# Altium project ControlSwitchPCB.PrjPcb
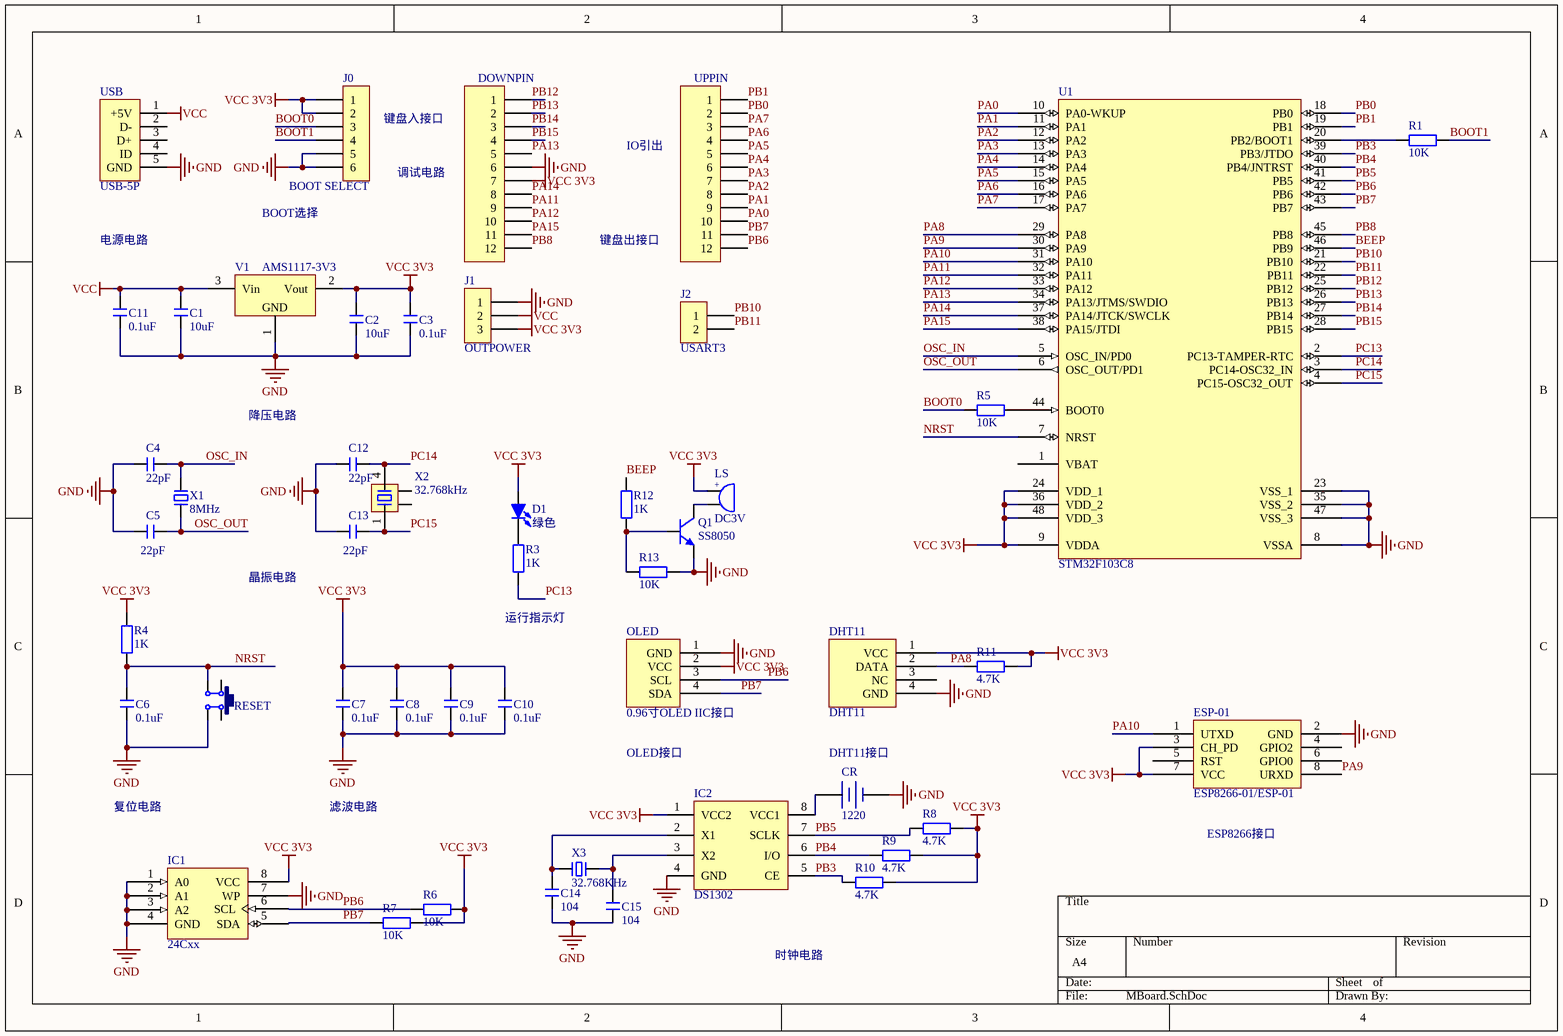
[diagram p0: MBoard.SchDoc]
3 sheets, 128 parts. Net scope: global (net labels, ports and power ports of the same name join across sheets).
Board files: MBoard.PcbDoc, SwitcherBoard.PcbDoc, MBoardBase.PcbDoc
Sheets:
  MBoard.SchDoc
  SwitcherBoard.SchDoc
  MBoardBase.SchDoc

## Sheet MBoard.SchDoc
size A4

### Parts
(Parts that share a designator on the sheet are numbered #1, #2 ... from top to bottom, then left to right.)
C1  10uF  [C 0805_L]
C2  10uF  [C 0805_L]
C3  0.1uF  [C 0805_L]
C4  22pF  [C 0805_L]
C5  22pF  [C 0805_L]
C6  0.1uF  [C 0805_L]
C7  0.1uF  [C 0805_L]
C8  0.1uF  [C 0805_L]
C9  0.1uF  [C 0805_L]
C10  0.1uF  [C 0805_L]
C11  0.1uF  [C 0805_L]
C12  22pF  [C 0805_L]
C13  22pF  [C 0805_L]
C14  104  [C 0805_L]
C15  104  [C 0805_L]
CR  1220  [CR1220_A]
D1  绿色  [LED 0805R]
DHT11  DHT11  [HDR2.54-LI-4P]
DOWNPIN  CON12  [HDR2.54-LI-12P]  (value not drawn)
ESP-01  ESP8266-01/ESP-01  [ESP-01S NOBRODER]
IC1  24Cxx  [SOP8_M]
IC2  DS1302  [SOP8_M]
J0  BOOT SELECT  [HDR2.54-LI-2x3P]
J1  OUTPOWER  [HDR2.54-LI-3P]
J2  USART3  [HDR2.54-WI-2P]
LS  DC3V  [BEEP 6.5x12x6]
OLED  0.96寸OLED IIC接口  [HDR2.54-M-LI-4P]
Q1  SS8050  [SOT23-3N]
R1  10K  [R 0805_L]
R3  1K  [R 0805_L]
R4  1K  [R 0805_L]
R5  10K  [R 0805_L]
R6  10K  [R 0805_L]
R7  10K  [R 0805_L]
R8  4.7K  [R 0805_L]
R9  4.7K  [R 0805_L]
R10  4.7K  [R 0805_L]
R11  4.7K  [R 0805_L]
R12  1K  [R 0805_L]
R13  10K  [R 0805_L]
RESET  6x6x5  [TSW SMD-6*6*4.3]  (value not drawn)
U1  STM32F103C8  [LQFP48 7X7_M]
UPPIN#1  CON12  [HDR2.54-LI-12P]  (value not drawn)
USB  USB-5P  [USB-MICRO_A]
V1  AMS1117-3V3  [SOT223_L]
X1  8MHz  [OSC HC-49S]
X2  32.768kHz  [OSC MC-306]
X3  32.768KHz  [OSC-2x6-WI-A]

### Nets
GND: C1.1 C2.1 C3.1 C4.1 C5.1 C6.1 C7.1 C8.1 C9.1 C10.1 C11.1 C12.1 C13.1 C14.1 C15.1 CR.2(DC-) DHT11.4(GND) DOWNPIN.6 ESP-01.2(GND) IC1.1(A0) IC1.2(A1) IC1.3(A2) IC1.4(GND) IC1.7(WP) IC2.4(GND) J0.5 J0.6 J1.1 OLED.1(GND) Q1.2(E) R13.2 RESET.3 U1.8(VSSA) U1.23(VSS_1) U1.35(VSS_2) U1.47(VSS_3) USB.5(GND) V1.1(GND)
VCC: C1.2 C11.2 J1.2 USB.1(+5V) V1.3(Vin)
VCC 3V3: C2.2 C3.2 C7.2 C8.2 C9.2 C10.2 D1.1(A) DHT11.1(VCC) DOWNPIN.7 ESP-01.3(CH_PD) ESP-01.7(VCC) IC1.8(VCC) IC2.1(VCC2) J0.1 J0.2 J1.3 LS.1 OLED.2(VCC) R4.2 R6.2 R7.2 R8.2 R9.2 R10.2 R11.2 U1.9(VDDA) U1.24(VDD_1) U1.36(VDD_2) U1.48(VDD_3) V1.2(Vout)
BEEP: R12.2 U1.46(PB9)
BOOT0: J0.3 R5.1
BOOT1: J0.4 R1.2
NRST: C6.2 R4.1 RESET.4 U1.7(NRST)
OSC_IN: C4.2 U1.5(OSC_IN/PD0) X1.2
OSC_OUT: C5.2 U1.6(OSC_OUT/PD1) X1.1
PA0: U1.10(PA0-WKUP) UPPIN#1.10
PA1: U1.11(PA1) UPPIN#1.9
PA2: U1.12(PA2) UPPIN#1.8
PA3: U1.13(PA3) UPPIN#1.7
PA4: U1.14(PA4) UPPIN#1.6
PA5: U1.15(PA5) UPPIN#1.5
PA6: U1.16(PA6) UPPIN#1.4
PA7: U1.17(PA7) UPPIN#1.3
PA8: DHT11.2(DATA) R11.1 U1.29(PA8)
PA9: ESP-01.8(URXD) U1.30(PA9)
PA10: ESP-01.1(UTXD) U1.31(PA10)
PA11: DOWNPIN.9 U1.32(PA11)
PA12: DOWNPIN.10 U1.33(PA12)
PA13: DOWNPIN.5 U1.34(PA13/JTMS/SWDIO)
PA14: DOWNPIN.8 U1.37(PA14/JTCK/SWCLK)
PA15: DOWNPIN.11 U1.38(PA15/JTDI)
PB0: U1.18(PB0) UPPIN#1.2
PB1: U1.19(PB1) UPPIN#1.1
PB3: IC2.5(CE) R10.1 U1.39(PB3/JTDO)
PB4: IC2.6(I/O) R9.1 U1.40(PB4/JNTRST)
PB5: IC2.7(SCLK) R8.1 U1.41(PB5)
PB6: IC1.6(SCL) OLED.3(SCL) R6.1 U1.42(PB6) UPPIN#1.12
PB7: IC1.5(SDA) OLED.4(SDA) R7.1 U1.43(PB7) UPPIN#1.11
PB8: DOWNPIN.12 U1.45(PB8)
PB10: J2.1 U1.21(PB10)
PB11: J2.2 U1.22(PB11)
PB12: DOWNPIN.1 U1.25(PB12)
PB13: DOWNPIN.2 U1.26(PB13)
PB14: DOWNPIN.3 U1.27(PB14)
PB15: DOWNPIN.4 U1.28(PB15)
PC13: R3.1 U1.2(PC13-TAMPER-RTC)
PC14: C12.2 U1.3(PC14-OSC32_IN) X2.4
PC15: C13.2 U1.4(PC15-OSC32_OUT) X2.1
NetC14_2: C14.2 IC2.2(X1) X3.1
NetC15_2: C15.2 IC2.3(X2) X3.2
NetCR_1: CR.1(DC+) IC2.8(VCC1)
NetD1_2: D1.2(K) R3.2
NetLS_2: LS.2 Q1.3(C)
NetQ1_1: Q1.1(B) R12.1 R13.1
NetR1_1: R1.1 U1.20(PB2/BOOT1)
NetR5_2: R5.2 U1.44(BOOT0)

Not connected (* = marked no-connect by the designer): DHT11 3(NC); ESP-01 4(GPIO2) 5(RST) 6(GPIO0); RESET 1 2; U1 1(VBAT); USB 2(D-) 3(D+) 4(ID); X2 2 3

### Notes on the sheet
- (near J0) 键盘入接口
- 调试电路
- IO引出
- 电源电路
- BOOT选择
- 键盘出接口
- 降压电路
- 晶振电路
- (near R3) 运行指示灯
- OLED接口
- (near CR) DHT11接口
- 复位电路
- 滤波电路
- ESP8266接口
- 时钟电路
- (in symbol BEEP) +

### Library data of the parts
C1-C15 = C: 无极性贴片电容; 版权归属: 源创客; BOM名称: 无极性贴片电容; 学习资源: www.ooocke.com
CR = CR-3V: 微型电池; 版权归属: 源创客; BOM名称: 微型电池; 学习资源: www.ooocke.com
D1 = LED-SMD: 贴片LED; 版权归属: 源创客; BOM名称: 贴片LED; 学习资源: www.ooocke.com
DOWNPIN UPPIN#1 = CON12: Connector
ESP-01 = ESP8266-01: ESP8266-01 接口
IC1 = 24Cxx: 外置EEPROM; 版权归属: 源创客; BOM名称: 外置EEPROM; 学习资源: www.ooocke.com
IC2 = DS1302: 实时时钟芯片; 版权归属: 源创客; BOM名称: 实时时钟芯片; 学习资源: www.ooocke.com
J0 = CON6: Connector
J1 = CON3: Connector
J2 = CON2: Connector
LS = BEEP: 蜂鸣器; 版权归属: 源创客; BOM名称: 蜂鸣器; 学习资源: www.ooocke.com
OLED = OLED0.96_IIC: 0.96寸OLED  IIC接口
Q1 = 8050-SMD: 高频放大-NPN型; 版权归属: 源创客; 属性: 40V 1.5A 1W 100MHZ; BOM名称: 高频放大-NPN型; 学习资源: www.ooocke.com
R1 R3-R13 = R: 贴片电阻; 版权归属: 源创客; BOM名称: 贴片电阻; 学习资源: www.ooocke.com
RESET = TSW SMD-6x6: 贴片6x6轻触开关; 版权归属: 源创客; BOM名称: 贴片6x6轻触开关; 学习资源: www.ooocke.com
U1 = STM32F103C8: Flaah:64/RAM:20/IO:36; BOM名称: 32位STM单片机; 版权归属: 源创客; 学习资源: www.ooocke.com
USB = USB-5P: 微型USB母座; 版权归属: 源创客; BOM名称: 微型USB母座; 学习资源: www.ooocke.com
V1 = AMS1117: 三端稳压芯片; BOM名称: 稳压芯片; 版权归属: 源创客; 学习资源: www.ooocke.com
X1 X3 = XTAL-2P: 2脚无源脚晶振; 版权归属: 源创客; BOM名称: 2脚无源脚晶振; 学习资源: www.ooocke.com
X2 = XTAL-MC-4P: MC系列4脚晶振; BOM名称: 2脚无源脚晶振; 版权归属: 源创客; 学习资源: www.ooocke.com

## Sheet SwitcherBoard.SchDoc
size A4
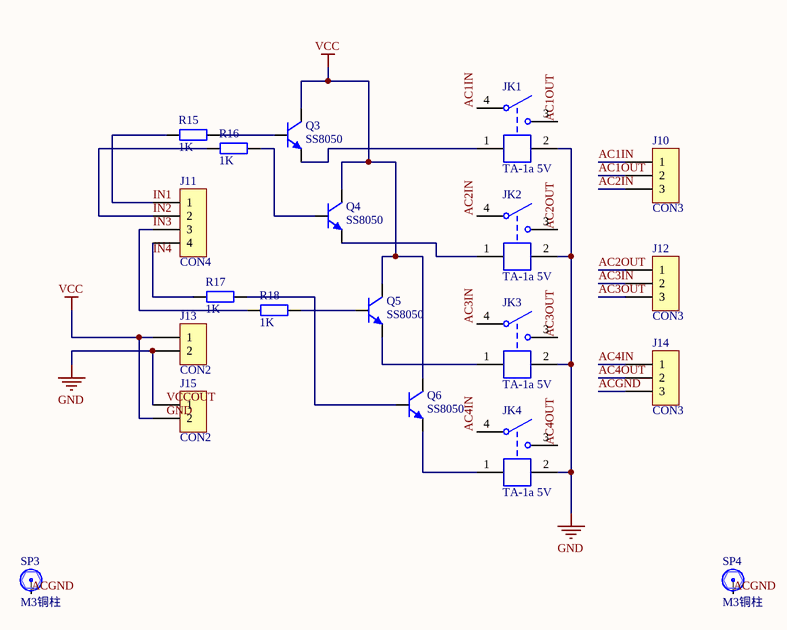
[diagram p1: SwitcherBoard.SchDoc]

### Parts
(Parts that share a designator on the sheet are numbered #1, #2 ... from top to bottom, then left to right.)
J10#1  CON3  [KF128-5.08-3P]
J11  CON4  [HDR2.54-WI-4P]
J12  CON3  [KF128-5.08-3P]
J13  CON2  [HDR2.54-WI-2P]
J14  CON3  [KF128-5.08-3P]
J15  CON2  [HDR2.54-WI-2P]
JK1  TA-1a 5V  [TA-1a]
JK2  TA-1a 5V  [TA-1a]
JK3  TA-1a 5V  [TA-1a]
JK4  TA-1a 5V  [TA-1a]
Q3  SS8050  [TO92A]
Q4  SS8050  [TO92A]
Q5  SS8050  [TO92A]
Q6  SS8050  [TO92A]
R15  1K  [RS 1/4W]
R16  1K  [RS 1/4W]
R17  1K  [RS 1/4W]
R18  1K  [RS 1/4W]
SP3  M3铜柱  [M3x4_L]
SP4  M3铜柱  [M3x4_L]

### Nets
GND: J13.2 J15.1 JK1.2 JK2.2 JK3.2 JK4.2
VCC: J13.1 J15.2 Q3.3(C) Q4.3(C) Q5.3(C) Q6.3(C)
AC1IN: J10#1.1 JK1.4
AC1OUT: J10#1.2 JK1.3
AC2IN: J10#1.3 JK2.4
AC2OUT: J12.1 JK2.3
AC3IN: J12.2 JK3.4
AC3OUT: J12.3 JK3.3
AC4IN: J14.1 JK4.4
AC4OUT: J14.2 JK4.3
ACGND: J14.3 SP3.1 SP4.1
IN1: J11.1 R15.1
IN2: J11.2 R16.1
IN3: J11.3 R18.1
IN4: J11.4 R17.1
NetJK1_1: JK1.1 Q3.1(E)
NetJK2_1: JK2.1 Q4.1(E)
NetJK3_1: JK3.1 Q5.1(E)
NetJK4_1: JK4.1 Q6.1(E)
NetQ3_2: Q3.2(B) R15.2
NetQ4_2: Q4.2(B) R16.2
NetQ5_2: Q5.2(B) R18.2
NetQ6_2: Q6.2(B) R17.2

### Notes on the sheet
- Labels drawn without touching a wire or pin: GND, VCCOUT

### Library data of the parts
J10#1 J12 J14 = CON3: Connector
J11 = CON4: Connector
J13 J15 = CON2: Connector
JK1-JK4 = TA-1a: 一组常开; BOM名称: 一组常开继电器; 版权归属: 源创客; 学习资源: www.ooocke.com
Q3-Q6 = 8050-DIP: 高频放大-NPN型; 版权归属: 源创客; 属性: 40V 1.5A 1W 100MHZ; BOM名称: 高频放大-NPN型; 学习资源: www.ooocke.com
R15-R18 = R-CRR: 直插色环电阻; BOM名称: 色环电阻; 版权归属: 源创客; 学习资源: www.ooocke.com
SP3 SP4 = 铜柱小焊盘: 铜柱; 版权归属: 源创客; BOM名称: 铜柱; 学习资源: www.ooocke.com

## Sheet MBoardBase.SchDoc
size 312 x 241 mm
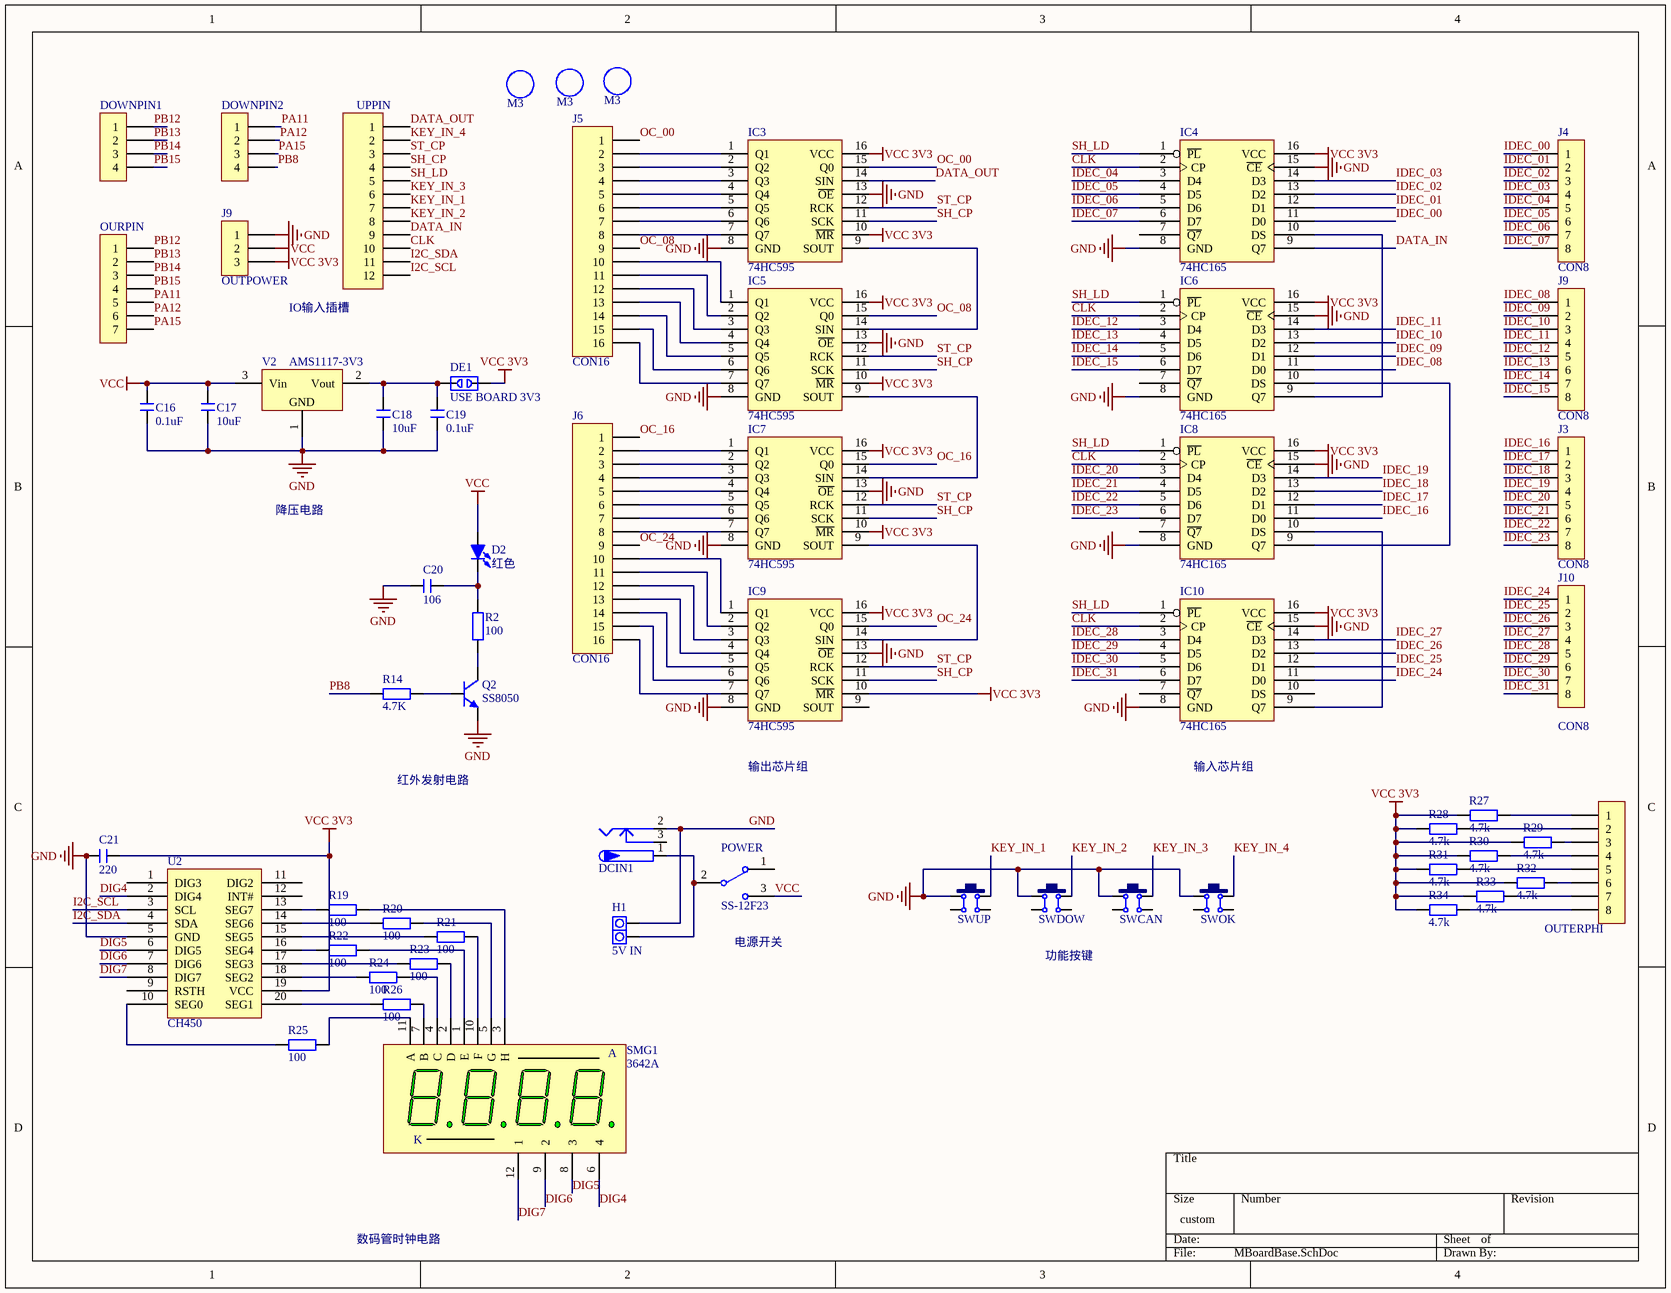
[diagram p2: MBoardBase.SchDoc]

### Parts
(Parts that share a designator on the sheet are numbered #1, #2 ... from top to bottom, then left to right.)
*#1  M3  [M3 125X200]
*#2  M3  [M3 125X200]
*#3  M3  [M3 125X200]
C16  0.1uF  [C 0805_L]
C17  10uF  [C 0805_L]
C18  10uF  [C 0805_L]
C19  0.1uF  [C 0805_L]
C20  106  [C 0805_L]
C21  220  [C 0805_L]
D2  红色  [LED 3MM-B]
DCIN1  DC5V  [DC-005]  (value not drawn)
DE1  USE BOARD 3V3  [DEBUG_A]
DOWNPIN1  CON4  [HDR2.54-M-LI-4P]  (value not drawn)
DOWNPIN2  CON4  [HDR2.54-M-LI-4P]  (value not drawn)
H1  5V IN  [PAD2-5.08]
IC3  74HC595  [SOP16_M]
IC4  74HC165  [SOP16_M]
IC5  74HC595  [SOP16_M]
IC6  74HC165  [SOP16_M]
IC7  74HC595  [SOP16_M]
IC8  74HC165  [SOP16_M]
IC9  74HC595  [SOP16_M]
IC10  74HC165  [SOP16_M]
J3  CON8  [FPC1.0-2H-WS-8P]
J4  CON8  [FPC1.0-2H-WS-8P]
J5  CON16  [HDR2.54-WI-2x8P]
J6  CON16  [HDR2.54-WI-2x8P]
J9#1  OUTPOWER  [HDR2.54-M-LI-3P]
J9#2  CON8  [FPC1.0-2H-WS-8P]
J10#2  CON8  [FPC1.0-2H-WS-8P]
OURPIN  CON7  [HDR2.54-LI-7P]  (value not drawn)
OUTERPHI  CON8  [HDR2.54-WI-2x4P]  (value not drawn)
POWER  SS-12F23  [SS-12F23]
Q2  SS8050  [SOT23-3L]
R2  100  [R 0805_L]
R14  4.7K  [R 0805_L]
R19  100  [R 0805_L]
R20  100  [R 0805_L]
R21  100  [R 0805_L]
R22  100  [R 0805_L]
R23  100  [R 0805_L]
R24  100  [R 0805_L]
R25  100  [R 0805_L]
R26  100  [R 0805_L]
R27  4.7k  [R 0805_L]
R28  4.7k  [R 0805_L]
R29  4.7k  [R 0805_L]
R30  4.7k  [R 0805_L]
R31  4.7k  [R 0805_L]
R32  4.7k  [R 0805_L]
R33  4.7k  [R 0805_L]
R34  4.7k  [R 0805_L]
SMG1  3642A  [SMG 0.36-4P]
SWCAN  CANCEL  [TSW SMD-6*6*4.3]  (value not drawn)
SWDOW  DOWN  [TSW SMD-6*6*4.3]  (value not drawn)
SWOK  OK  [TSW SMD-6*6*4.3]  (value not drawn)
SWUP  UP  [TSW SMD-6*6*4.3]  (value not drawn)
U2  CH450  [sop20_m]
UPPIN#2  CON12  [HDR2.54-M-LI-12P]  (value not drawn)
V2  AMS1117-3V3  [SOT223_L]

### Nets
GND: C16.1 C17.1 C18.1 C19.1 C20.1 C21.1 DCIN1.2 H1.2 IC3.8(GND) IC3.13(~{OE}) IC4.8(GND) IC4.15(~{CE}) IC5.8(GND) IC5.13(~{OE}) IC6.8(GND) IC6.15(~{CE}) IC7.8(GND) IC7.13(~{OE}) IC8.8(GND) IC8.15(~{CE}) IC9.8(GND) IC9.13(~{OE}) IC10.8(GND) IC10.15(~{CE}) J9#1.1 Q2.1(E) SWCAN.1 SWDOW.1 SWOK.1 SWUP.1 U2.5(GND) V2.1(GND)
VCC: C16.2 C17.2 D2.1(A) J9#1.2 POWER.3 V2.3(Vin)
VCC 3V3: C21.2 DE1.2 IC3.10(~{MR}) IC3.16(VCC) IC4.16(VCC) IC5.10(~{MR}) IC5.16(VCC) IC6.16(VCC) IC7.10(~{MR}) IC7.16(VCC) IC8.16(VCC) IC9.10(~{MR}) IC9.16(VCC) IC10.16(VCC) J9#1.3 R27.1 R28.1 R29.1 R30.1 R31.1 R32.1 R33.1 R34.1 U2.19(VCC)
CLK: IC4.2(CP) IC6.2(CP) IC8.2(CP) IC10.2(CP) UPPIN#2.10
DATA_IN: IC4.9(Q7) UPPIN#2.9
DATA_OUT: IC3.14(SIN) UPPIN#2.1
DIG4: SMG1.6(4) U2.2(DIG4)
DIG5: SMG1.8(3) U2.6(DIG5)
DIG6: SMG1.9(2) U2.7(DIG6)
DIG7: SMG1.12(1) U2.8(DIG7)
I2C_SCL: U2.3(SCL) UPPIN#2.12
I2C_SDA: U2.4(SDA) UPPIN#2.11
IDEC_00: IC4.11(D0) J4.1
IDEC_01: IC4.12(D1) J4.2
IDEC_02: IC4.13(D2) J4.3
IDEC_03: IC4.14(D3) J4.4
IDEC_04: IC4.3(D4) J4.5
IDEC_05: IC4.4(D5) J4.6
IDEC_06: IC4.5(D6) J4.7
IDEC_07: IC4.6(D7) J4.8
IDEC_08: IC6.11(D0) J9#2.1
IDEC_09: IC6.12(D1) J9#2.2
IDEC_10: IC6.13(D2) J9#2.3
IDEC_11: IC6.14(D3) J9#2.4
IDEC_12: IC6.3(D4) J9#2.5
IDEC_13: IC6.4(D5) J9#2.6
IDEC_14: IC6.5(D6) J9#2.7
IDEC_15: IC6.6(D7) J9#2.8
IDEC_16: IC8.11(D0) J3.1
IDEC_17: IC8.12(D1) J3.2
IDEC_18: IC8.13(D2) J3.3
IDEC_19: IC8.14(D3) J3.4
IDEC_20: IC8.3(D4) J3.5
IDEC_21: IC8.4(D5) J3.6
IDEC_22: IC8.5(D6) J3.7
IDEC_23: IC8.6(D7) J3.8
IDEC_24: IC10.11(D0) J10#2.1
IDEC_25: IC10.12(D1) J10#2.2
IDEC_26: IC10.13(D2) J10#2.3
IDEC_27: IC10.14(D3) J10#2.4
IDEC_28: IC10.3(D4) J10#2.5
IDEC_29: IC10.4(D5) J10#2.6
IDEC_30: IC10.5(D6) J10#2.7
IDEC_31: IC10.6(D7) J10#2.8
KEY_IN_1: SWUP.2 UPPIN#2.7
KEY_IN_2: SWDOW.2 UPPIN#2.8
KEY_IN_3: SWCAN.2 UPPIN#2.6
KEY_IN_4: SWOK.2 UPPIN#2.2
OC_00: IC3.15(Q0) J5.1
OC_08: IC5.15(Q0) J5.9
OC_16: IC7.15(Q0) J6.1
OC_24: IC9.15(Q0) J6.9
PA11: DOWNPIN2.1 OURPIN.5
PA12: DOWNPIN2.2 OURPIN.6
PA15: DOWNPIN2.3 OURPIN.7
PB8: DOWNPIN2.4 R14.1
PB12: DOWNPIN1.1 OURPIN.1
PB13: DOWNPIN1.2 OURPIN.2
PB14: DOWNPIN1.3 OURPIN.3
PB15: DOWNPIN1.4 OURPIN.4
SH_CP: IC3.11(SCK) IC5.11(SCK) IC7.11(SCK) IC9.11(SCK) UPPIN#2.4
SH_LD: IC4.1(~{PL}) IC6.1(~{PL}) IC8.1(~{PL}) IC10.1(~{PL}) UPPIN#2.5
ST_CP: IC3.12(RCK) IC5.12(RCK) IC7.12(RCK) IC9.12(RCK) UPPIN#2.3
NetC18_2: C18.2 C19.2 DE1.1 V2.2(Vout)
NetC20_2: C20.2 D2.2(K) R2.2
NetDCIN1_1: DCIN1.1 H1.1 POWER.2
NetIC3_1: IC3.1(Q1) J5.2
NetIC3_2: IC3.2(Q2) J5.3
NetIC3_3: IC3.3(Q3) J5.4
NetIC3_4: IC3.4(Q4) J5.5
NetIC3_5: IC3.5(Q5) J5.6
NetIC3_6: IC3.6(Q6) J5.7
NetIC3_7: IC3.7(Q7) J5.8
NetIC3_9: IC3.9(SOUT) IC5.14(SIN)
NetIC4_10: IC4.10(DS) IC6.9(Q7)
NetIC5_1: IC5.1(Q1) J5.10
NetIC5_2: IC5.2(Q2) J5.11
NetIC5_3: IC5.3(Q3) J5.12
NetIC5_4: IC5.4(Q4) J5.13
NetIC5_5: IC5.5(Q5) J5.14
NetIC5_6: IC5.6(Q6) J5.15
NetIC5_7: IC5.7(Q7) J5.16
NetIC5_9: IC5.9(SOUT) IC7.14(SIN)
NetIC6_10: IC6.10(DS) IC8.9(Q7)
NetIC7_1: IC7.1(Q1) J6.2
NetIC7_2: IC7.2(Q2) J6.3
NetIC7_3: IC7.3(Q3) J6.4
NetIC7_4: IC7.4(Q4) J6.5
NetIC7_5: IC7.5(Q5) J6.6
NetIC7_6: IC7.6(Q6) J6.7
NetIC7_7: IC7.7(Q7) J6.8
NetIC7_9: IC7.9(SOUT) IC9.14(SIN)
NetIC8_10: IC8.10(DS) IC10.9(Q7)
NetIC9_1: IC9.1(Q1) J6.10
NetIC9_2: IC9.2(Q2) J6.11
NetIC9_3: IC9.3(Q3) J6.12
NetIC9_4: IC9.4(Q4) J6.13
NetIC9_5: IC9.5(Q5) J6.14
NetIC9_6: IC9.6(Q6) J6.15
NetIC9_7: IC9.7(Q7) J6.16
NetOUTERPHI_1: OUTERPHI.1 R27.2
NetOUTERPHI_2: OUTERPHI.2 R28.2
NetOUTERPHI_3: OUTERPHI.3 R29.2
NetOUTERPHI_4: OUTERPHI.4 R30.2
NetOUTERPHI_5: OUTERPHI.5 R31.2
NetOUTERPHI_6: OUTERPHI.6 R32.2
NetOUTERPHI_7: OUTERPHI.7 R33.2
NetOUTERPHI_8: OUTERPHI.8 R34.2
NetQ2_2: Q2.2(B) R14.2
NetQ2_3: Q2.3(C) R2.1
NetR19_1: R19.1 U2.13(SEG7)
NetR19_2: R19.2 SMG1.3(H)
NetR20_1: R20.1 U2.14(SEG6)
NetR20_2: R20.2 SMG1.5(G)
NetR21_1: R21.1 U2.15(SEG5)
NetR21_2: R21.2 SMG1.10(F)
NetR22_1: R22.1 U2.16(SEG4)
NetR22_2: R22.2 SMG1.1(E)
NetR23_1: R23.1 U2.17(SEG3)
NetR23_2: R23.2 SMG1.2(D)
NetR24_1: R24.1 U2.18(SEG2)
NetR24_2: R24.2 SMG1.4(C)
NetR25_1: R25.1 U2.10(SEG0)
NetR25_2: R25.2 SMG1.11(A)
NetR26_1: R26.1 U2.20(SEG1)
NetR26_2: R26.2 SMG1.7(B)

Not connected (* = marked no-connect by the designer): DCIN1 3; IC4 7(~{Q7}); IC6 7(~{Q7}); IC8 7(~{Q7}); IC9 9(SOUT); IC10 7(~{Q7}) 10(DS); POWER 1; SWCAN 3 4; SWDOW 3 4; SWOK 3 4; SWUP 3 4; U2 1(DIG3) 9(RSTH) 11(DIG2) 12(INT#)

### Notes on the sheet
- IO输入插槽
- 降压电路
- 输出芯片组
- 输入芯片组
- 红外发射电路
- (near POWER) 电源开关
- (near SWDOW) 功能按键
- 数码管时钟电路
- (in symbol 3641A) K

### Library data of the parts
*#1-*#3 = M3: 铜柱孔; 版权归属: 源创客; BOM名称: 铜柱孔; 学习资源: www.ooocke.com
C16-C21 = C: 无极性贴片电容; 版权归属: 源创客; BOM名称: 无极性贴片电容; 学习资源: www.ooocke.com
D2 = LED-3MM: 插件LED; 版权归属: 源创客; BOM名称: 插件LED; 学习资源: www.ooocke.com
DCIN1 = P-DC: 低压电源接口; BOM名称: DC电源接口; 版权归属: 源创客; 学习资源: www.ooocke.com
DE1 = DEBUG: 调试断点焊盘; 版权归属: 源创客; BOM名称: 调试断点焊盘; 学习资源: www.ooocke.com
DOWNPIN1 DOWNPIN2 = CON4: Connector
H1 = PAD2: 引线焊盘; 版权归属: 源创客; BOM名称: 引线焊盘; 学习资源: www.ooocke.com
IC3 IC5 IC7 IC9 = 74HC595: 8位移位寄存器; 版权归属: 源创客; BOM名称: 8位移位寄存器; 学习资源: www.ooocke.com
J3 J4 J9#2 J10#2 OUTERPHI = CON8: Connector
J5 J6 = CON16: Connector
J9#1 = CON3: Connector
OURPIN = CON7: Connector
POWER = SSW-1P: 1路波动开关; BOM名称: 波动开关; 版权归属: 源创客; 学习资源: www.ooocke.com
Q2 = 8050-DIP: as Q3 on sheet SwitcherBoard; BOM名称: 高频放大-NPN型; 学习资源: www.ooocke.com
R2 R14 R19-R34 = R: 贴片电阻; 版权归属: 源创客; BOM名称: 贴片电阻; 学习资源: www.ooocke.com
SMG1 = 3641A: 0.36寸4位共阴数码管; 版权归属: 源创客; BOM名称: 0.36寸4位共阴; 学习资源: www.ooocke.com
SWCAN SWDOW SWOK SWUP = TSW SMD-6x6: 贴片6x6轻触开关; 版权归属: 源创客; BOM名称: 贴片6x6轻触开关; 学习资源: www.ooocke.com
UPPIN#2 = CON12: Connector
V2 = AMS1117: 三端稳压芯片; BOM名称: 稳压芯片; 版权归属: 源创客; 学习资源: www.ooocke.com

## Nets that join several sheets
GND: MBoard (38 pins), SwitcherBoard (6 pins), MBoardBase (32 pins)
VCC: MBoard (5 pins), SwitcherBoard (6 pins), MBoardBase (6 pins)
VCC 3V3: MBoard (30 pins), MBoardBase (24 pins)
PA11: MBoard (DOWNPIN.9 U1.32), MBoardBase (DOWNPIN2.1 OURPIN.5)
PA12: MBoard (DOWNPIN.10 U1.33), MBoardBase (DOWNPIN2.2 OURPIN.6)
PA15: MBoard (DOWNPIN.11 U1.38), MBoardBase (DOWNPIN2.3 OURPIN.7)
PB8: MBoard (DOWNPIN.12 U1.45), MBoardBase (DOWNPIN2.4 R14.1)
PB12: MBoard (DOWNPIN.1 U1.25), MBoardBase (DOWNPIN1.1 OURPIN.1)
PB13: MBoard (DOWNPIN.2 U1.26), MBoardBase (DOWNPIN1.2 OURPIN.2)
PB14: MBoard (DOWNPIN.3 U1.27), MBoardBase (DOWNPIN1.3 OURPIN.3)
PB15: MBoard (DOWNPIN.4 U1.28), MBoardBase (DOWNPIN1.4 OURPIN.4)